# Altium schematic sheet LCD_board.SchDoc
size A4
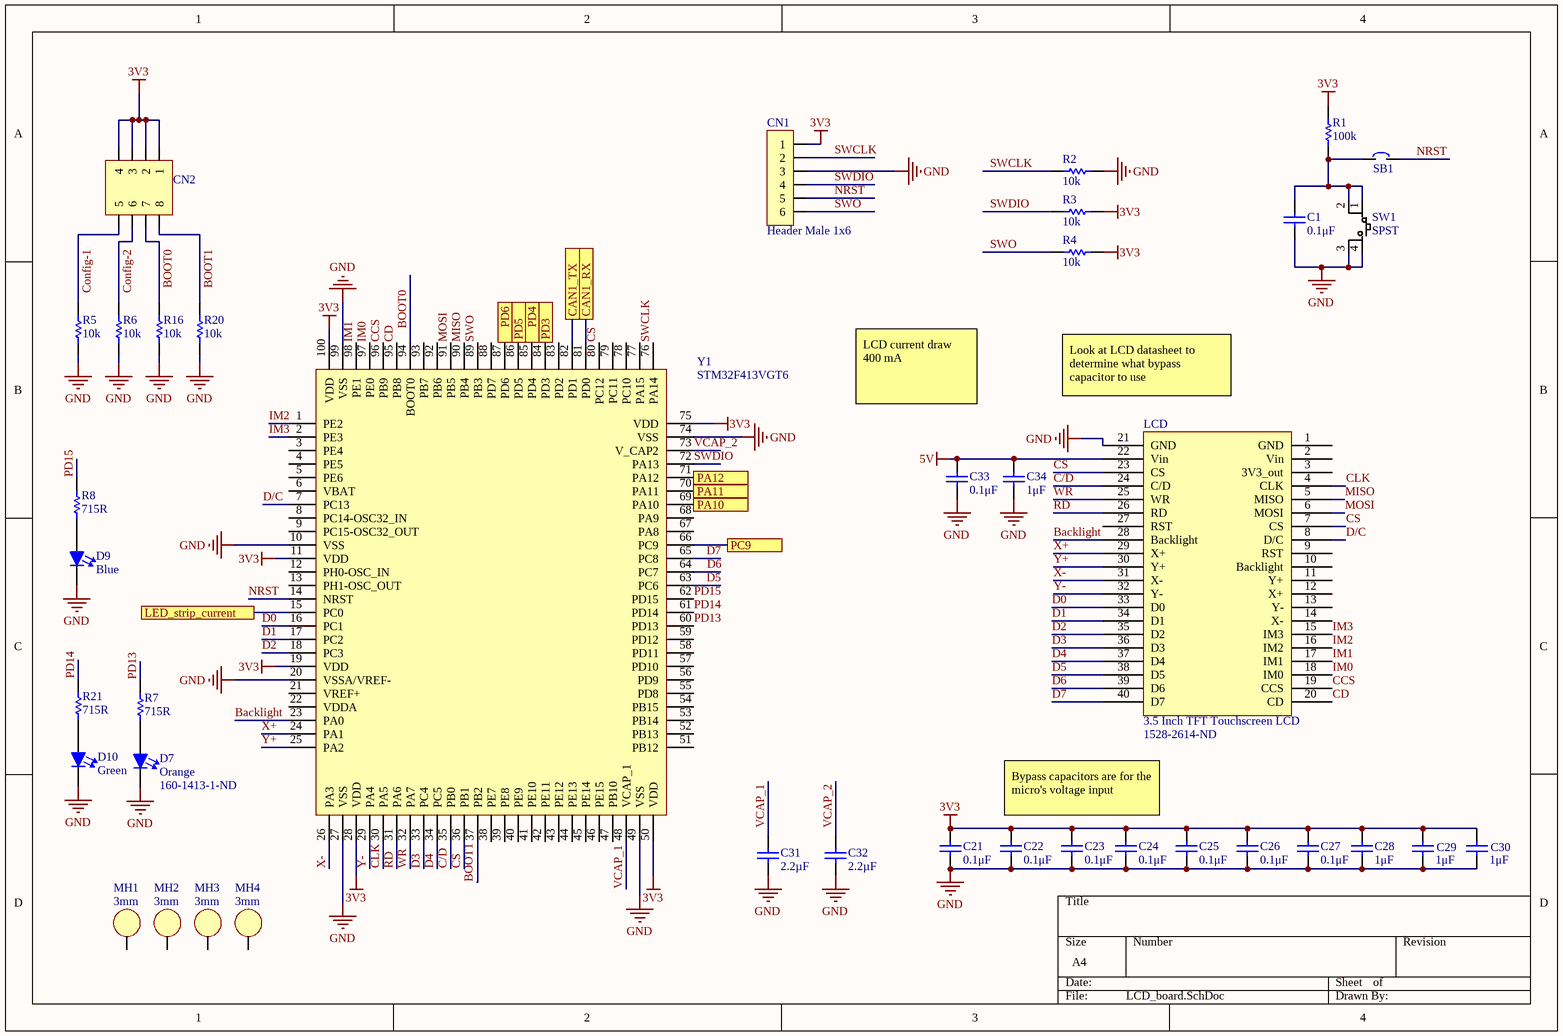
[diagram p0: LCD_board.SchDoc]

## Parts
C1  0.1μF  [CAPC1608N(0603")]
C21  0.1μF  [CAPC1608N(0603")]
C22  0.1μF  [CAPC1608N(0603")]
C23  0.1μF  [CAPC1608N(0603")]
C24  0.1μF  [CAPC1608N(0603")]
C25  0.1μF  [CAPC1608N(0603")]
C26  0.1μF  [CAPC1608N(0603")]
C27  0.1μF  [CAPC1608N(0603")]
C28  1μF  [CAPC1608N(0603")]
C29  1μF  [CAPC1608N(0603")]
C30  1μF  [CAPC1608N(0603")]
C31  2.2µF  [CAPC1608N(0603")]
C32  2.2µF  [CAPC1608N(0603")]
C33  0.1μF  [CAPC1608N(0603")]
C34  1μF  [CAPC1608N(0603")]
CN1  Header Male 1x6  [Header, Male, 1X6]
CN2  Header, Male, 2x4, Pitch: 0.1" (2.54mm), THT  [Header, Male, 2x4, Pitch: 0.1" (2.54mm),THT]  (value not drawn)
D7  Orange  Supplier Part Number 1: 160-1413-1-ND  [LED0805]
D9  Blue  [LED0805]
D10  Green  [LED0805]
LCD  3.5 Inch TFT Touchscreen LCD  Supplier Part Number 1: 1528-2614-ND  [LCD_touchscreen_tft]
MH1  3mm  [Mount-Hole_3mm]
MH2  3mm  [Mount-Hole_3mm]
MH3  3mm  [Mount-Hole_3mm]
MH4  3mm  [Mount-Hole_3mm]
R1  100k  [RESC1608N(0603")]
R2  10k  [RESC1608N(0603")]
R3  10k  [RESC1608N(0603")]
R4  10k  [RESC1608N(0603")]
R5  10k  [RESC1608N(0603")]
R6  10k  [RESC1608N(0603")]
R7  715R  [RESC1608N(0603")]
R8  715R  [RESC1608N(0603")]
R16  10k  [RESC1608N(0603")]
R20  10k  [RESC1608N(0603")]
R21  715R  [RESC1608N(0603")]
SB1  Solder Bridge  [Solder Bridge]  (value not drawn)
SW1  SPST  [4-SPST-NO]
Y1  STM32F413VGT6  [STM-LQFP100_M]

## Ports
CAN1_RX, CAN1_TX, LED_strip_current, PA10, PA11, PA12, PC9, PD3, PD4, PD5, PD6

## Nets
3V3: C21.2(Cathode) C22.2(Cathode) C23.2(Cathode) C24.2(Cathode) C25.2(Cathode) C26.2(Cathode) C27.2(Cathode) C28.2(Cathode) C29.2(Cathode) C30.2(Cathode) CN1.1 CN2.1 CN2.2 CN2.3 CN2.4 R1.2 R3.2 R4.2 Y1.11(VDD) Y1.19(VDD) Y1.28(VDD) Y1.50(VDD) Y1.75(VDD) Y1.100(VDD)
5V: C33.2(Cathode) C34.2(Cathode) LCD.22(Vin)
GND: C1.1(Anode) C21.1(Anode) C22.1(Anode) C23.1(Anode) C24.1(Anode) C25.1(Anode) C26.1(Anode) C27.1(Anode) C28.1(Anode) C29.1(Anode) C30.1(Anode) C31.1(Anode) C32.1(Anode) C33.1(Anode) C34.1(Anode) CN1.3 D7.1(Cathode) D9.1(Cathode) D10.1(Cathode) LCD.21(GND) R2.1 R5.1 R6.1 R16.1 R20.1 SW1.3 SW1.4 Y1.10(VSS) Y1.20(VSSA/VREF-) Y1.27(VSS) Y1.49(VSS) Y1.74(VSS) Y1.99(VSS)
Backlight: LCD.28(Backlight) Y1.23(PA0)
BOOT0: CN2.7 R16.2 Y1.94(BOOT0)
BOOT1: CN2.8 R20.2 Y1.37(PB2)
C/D: LCD.24(C/D) Y1.35(PB0)
CAN1_RX: Y1.81(PD0) ; port CAN1_RX
CAN1_TX: Y1.82(PD1) ; port CAN1_TX
CCS: LCD.19(CCS) Y1.96(PB9)
CD: LCD.20(CD) Y1.95(PB8)
CLK: LCD.4(CLK) Y1.30(PA5)
Config-1: CN2.5 R5.2
Config-2: CN2.6 R6.2
CS: LCD.7(CS) LCD.23(CS) Y1.36(PB1) Y1.80(PC12)
D0: LCD.33(D0) Y1.16(PC1)
D1: LCD.34(D1) Y1.17(PC2)
D2: LCD.35(D2) Y1.18(PC3)
D3: LCD.36(D3) Y1.33(PC4)
D4: LCD.37(D4) Y1.34(PC5)
D5: LCD.38(D5) Y1.63(PC6)
D6: LCD.39(D6) Y1.64(PC7)
D7: LCD.40(D7) Y1.65(PC8)
D/C: LCD.8(D/C) Y1.7(PC13)
IM0: LCD.18(IM0) Y1.97(PE0)
IM1: LCD.17(IM1) Y1.98(PE1)
IM2: LCD.16(IM2) Y1.1(PE2)
IM3: LCD.15(IM3) Y1.2(PE3)
LED_strip_current: Y1.15(PC0) ; port LED_strip_current
MISO: LCD.5(MISO) Y1.90(PB4)
MOSI: LCD.6(MOSI) Y1.91(PB5)
NRST: CN1.5 SB1.2 Y1.14(NRST)
PA10: Y1.69(PA10) ; port PA10
PA11: Y1.70(PA11) ; port PA11
PA12: Y1.71(PA12) ; port PA12
PC9: Y1.66(PC9) ; port PC9
PD3: Y1.84(PD3) ; port PD3
PD4: Y1.85(PD4) ; port PD4
PD5: Y1.86(PD5) ; port PD5
PD6: Y1.87(PD6) ; port PD6
PD13: R7.2 Y1.60(PD13)
PD14: R21.2 Y1.61(PD14)
PD15: R8.2 Y1.62(PD15)
RD: LCD.26(RD) Y1.31(PA6)
SWCLK: CN1.2 R2.2 Y1.76(PA14)
SWDIO: CN1.4 R3.1 Y1.72(PA13)
SWO: CN1.6 R4.1 Y1.89(PB3)
VCAP_1: C31.2(Cathode) Y1.48(VCAP_1)
VCAP_2: C32.2(Cathode) Y1.73(V_CAP2)
WR: LCD.25(WR) Y1.32(PA7)
X+: LCD.29(X+) Y1.24(PA1)
X-: LCD.31(X-) Y1.26(PA3)
Y+: LCD.30(Y+) Y1.25(PA2)
Y-: LCD.32(Y-) Y1.29(PA4)
NetC1_2: C1.2(Cathode) R1.1 SB1.1 SW1.1 SW1.2
NetD7_2: D7.2(Anode) R7.1
NetD9_2: D9.2(Anode) R8.1
NetD10_2: D10.2(Anode) R21.1

Not connected (* = marked no-connect by the designer): LCD 1(GND) 2(Vin) 3(3V3_out) 9(RST) 10(Backlight) 11(Y+) 12(X+) 13(Y-) 14(X-) 27(RST); MH1 1; MH2 1; MH3 1; MH4 1; Y1 3(PE4) 4(PE5) 5(PE6) 6(VBAT) 8(PC14-OSC32_IN) 9(PC15-OSC32_OUT) 12(PH0-OSC_IN) 13(PH1-OSC_OUT) 21(VREF+) 22(VDDA) 38(PE7) 39(PE8) 40(PE9) 41(PE10) 42(PE11) 43(PE12) 44(PE13) 45(PE14) 46(PE15) 47(PB10) 51(PB12) 52(PB13) 53(PB14) 54(PB15) 55(PD8) 56(PD9) 57(PD10) 58(PD11) 59(PD12) 67(PA8) 68(PA9) 77(PA15) 78(PC10) 79(PC11) 83(PD2) 88(PD7) 92(PB6) 93(PB7)

## Notes on the sheet
- LCD current draw 400 mA
- (near LCD) Look at LCD datasheet to determine what bypass capacitor to use
- Bypass capacitors are for the micro's voltage input

## Library data of the parts
C1 C21-C27 C33 = 0.1uF 100V 0603 SMD, Ceramic: Capacitor, Ceramic, 100V, +/- 10%, 0603 SMD, X7R; MFG: TDK; MFG#: CGA3E3X7S2A104K080AB; Published: 16-04-26; Publisher: AUVic; PackageDescription: Chip Capacitor; Value: 0.1μF; Created By: Ashwin Sira; Supplier 1: Digi-Key; Supplier Part Number 1: 445-6938-1-ND
C28-C30 C34 = 1uF 25V 0603 SMD, Ceramic: Capacitor, Ceramic, 25V, +/- 10%, 0603 SMD, X5R; MFG: Murata-Electronics-North-America; MFG#: GRM188R61E105KA12D; Published: 16-06-27; Publisher: AUVic; PackageDescription: Chip Capacitor; Value: 1μF; Created By: Andy Bates; Supplier 1: Digi-Key; Supplier Part Number 1: 490-3897-1-ND
C31 C32 = 2.2uF, 50V, 0603 SMD, X5R, Ceramic: Capacitor, Ceramic, 50V, 10%, 0603 SMD, X5R; Date Created: *; PackageDescription: Chip Capacitor; Value: 2.2µF; Made By: *; Publisher: AUVic; Supplier 1: Digi-Key; Supplier Part Number 1: 490-10733-1-ND
CN1 = Header, Male, 1x6: 1x6, Pads Pitch: 0.1" (2.54mm), Through hole; Made Bates: Andy Bates; Supplier 1: Digikey; Supplier 1 Part Number: 952-2270-ND
D7 = LED, 0805 (2012), Orange, Clear: Colour: Orange; Created By: Robert Keen; ComponentLink1Description: Digikey; ComponentLink1URL: https://www.digikey.ca/product-detail/en/lite-on-inc/LTST-C170KFKT/160-1413-1-ND/386774; Supplier 1: Digi-Key
D9 = LED, 0805 (2012), Blue, Clear: Colour: Red; Created By: Ashwin Sira; Supplier 1: Digi-Key; Supplier Part Number 1: 732-4982-1-ND
D10 = LED, 0805 (2012), Green, Clear: Colour: Green; Created By: Andy Bates; Supplier 1: Digi-Key; Supplier Part Number 1: 475-1410-1-ND
LCD = Adafruit ILI9341: 3.2" TFT LCD with Touchscreen Breakout Board w/MicroSD Socket; ComponentLink1Description: Adafruit; ComponentLink1URL: https://www.adafruit.com/product/1743; ComponentLink2Description: Datasheet; ComponentLink2URL: https://cdn-shop.adafruit.com/datasheets/ILI9341.pdf; ComponentLink3Description: Raw LCD Datasheet; ComponentLink3URL: https://cdn-shop.adafruit.com/datasheets/MI0283QT-11+V1.1.PDF; ComponentLink4Description: DigiKey; ComponentLink4URL: https://www.digikey.ca/products/en/optoelectronics/display-modules-lcd-oled-graphic/107?k=&pkeyword=&pv652=165&FV=ffe0006b%2Cfffc05f8&quantity=0&ColumnSort=0&page=1&pageSize=25; ComponentLink5Description: Adafruit Guide; ComponentLink5URL: https://cdn-learn.adafruit.com/downloads/pdf/adafruit-2-dot-8-color-tft-touchscreen-breakout-v2.pdf; Supplier 1: Digi-Key; Supplier 2: Digi-Key; Supplier Part Number 2: S7053-ND
MH1-MH4 = Mount_Hole_3mm
R1 = 100kR, 1%, 1/10W, 0603 SMD: Made By: Andy Bates; Owned By: AUVic; Created On: 14-06-30; Last Edited: 14-06-30; Value: 100k; Supplier 1: Digi-Key; Supplier Part Number 1: 311-100KGRCT-ND
R2-R6 R16 R20 = 10kR, 1%, 1/10W, 0603 SMD: Made By: Ashwin Sira; Owned By: AUVic; Created On: 14-05-31; Last Edited: 14-05-31; Supplier 1: Digi-Key; Supplier Part Number 1: 311-10.0KHRCT-ND; Value: 10k
R7 R8 R21 = 715R, 1%, 1/10W, 0603, SMD: Created By: Ashwin Sira; Publisher: AUVic; Date Created: 2016-06-10; Value: 715R; Supplier 1: Digi-Key; Supplier Part Number 1: 541-715HCT-ND
SB1 = Solder Bridge: Made By: Andy Bates; Created On: 2016/09/08
SW1 = 4 pin Tacitle Switch: Made By: Andy Bates; Button Type: Single Pole Single Throw; Supplier 1: Digikey; Supplier 1 Part Number: CKN9084CT-ND
Y1 = STM32F413VGT6: ARM Cortex-M4 32-bit MCU, 180 MHz, 320 KB Internal Rap, 81 I/O, 100-pin LQFP, -40 to 85 degC, Tray; Core Size: 32-bit; Supplier 1: Digi-Key; Supplier: Digikey; Supplier Part Number 1: 497-17009-ND
CN2 = Header, Male, 2x4, Pitch: 0.1" (2.54mm), THT: Publisher: AUVic; Date Published: 2017-09-13; Last Updated: *; Reviewed By: *; Created By: Andy Bates